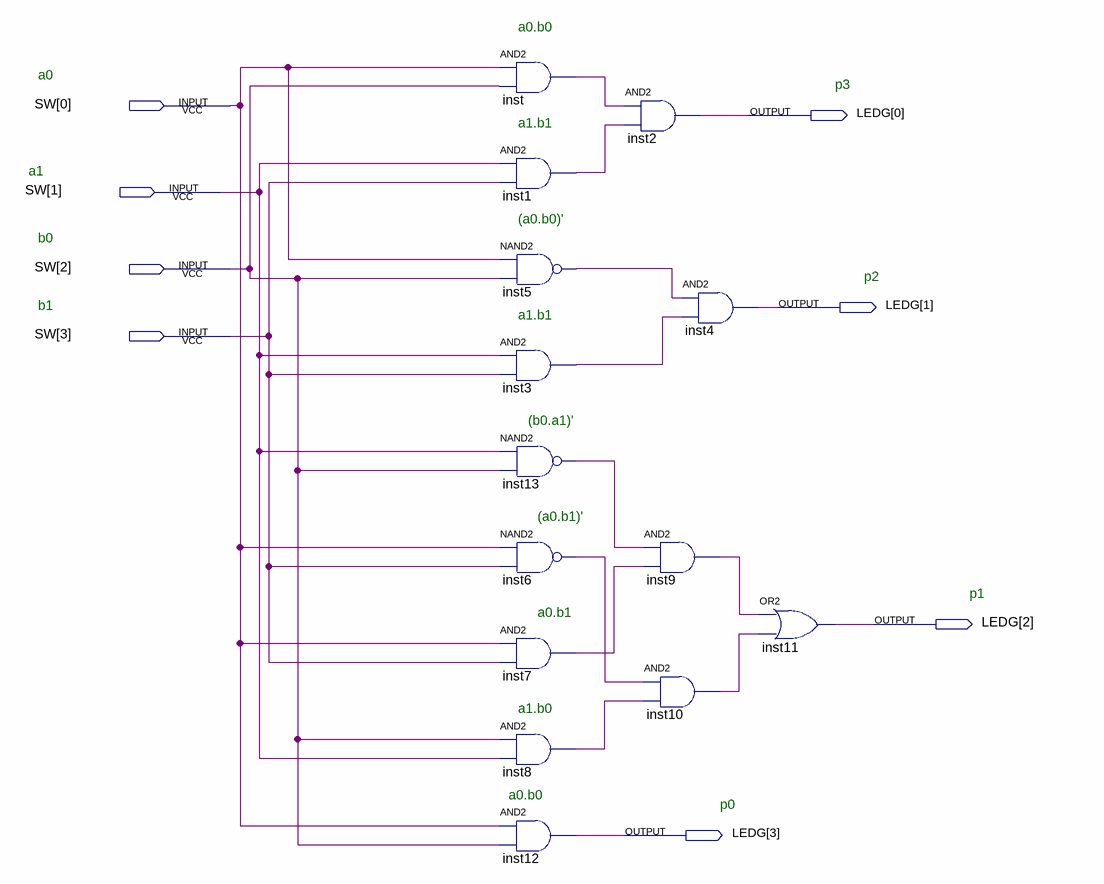
[diagram p0: schematic sheet]
// Quartus schematic BME_393L__lab_2__3_1_schematic_entry.bdf as structural Verilog: 14 symbols, 8 pins
module BME_393L__lab_2__3_1_schematic_entry (
  input  [3:0] SW,
  output [3:0] LEDG
);

  wire inst1_out, inst3_out, inst5_out, inst6_out, inst7_out, inst8_out, inst9_out, inst10_out, inst13_out,
       inst_out;

  and inst (inst_out, SW[0], SW[2]);
  and inst1 (inst1_out, SW[1], SW[3]);
  nand inst5 (inst5_out, SW[0], SW[2]);
  and inst3 (inst3_out, SW[1], SW[3]);
  nand inst13 (inst13_out, SW[1], SW[2]);
  nand inst6 (inst6_out, SW[0], SW[3]);
  and inst7 (inst7_out, SW[0], SW[3]);
  and inst8 (inst8_out, SW[2], SW[1]);
  and inst12 (LEDG[3], SW[0], SW[2]);
  and inst2 (LEDG[0], inst_out, inst1_out);
  and inst4 (LEDG[1], inst5_out, inst3_out);
  and inst9 (inst9_out, inst13_out, inst7_out);
  and inst10 (inst10_out, inst6_out, inst8_out);
  or inst11 (LEDG[2], inst9_out, inst10_out);

  // Notes on the sheet:
  //   a0.b0
  //   a0
  //   p3
  //   a1.b1
  //   a1
  //   (a0.b0)'
  //   b0
  //   p2
  //   b1
  //   a1.b1
  //   (b0.a1)'
  //   (a0.b1)'
  //   p1
  //   a0.b1
  //   a1.b0
  //   a0.b0
  //   p0
endmodule
